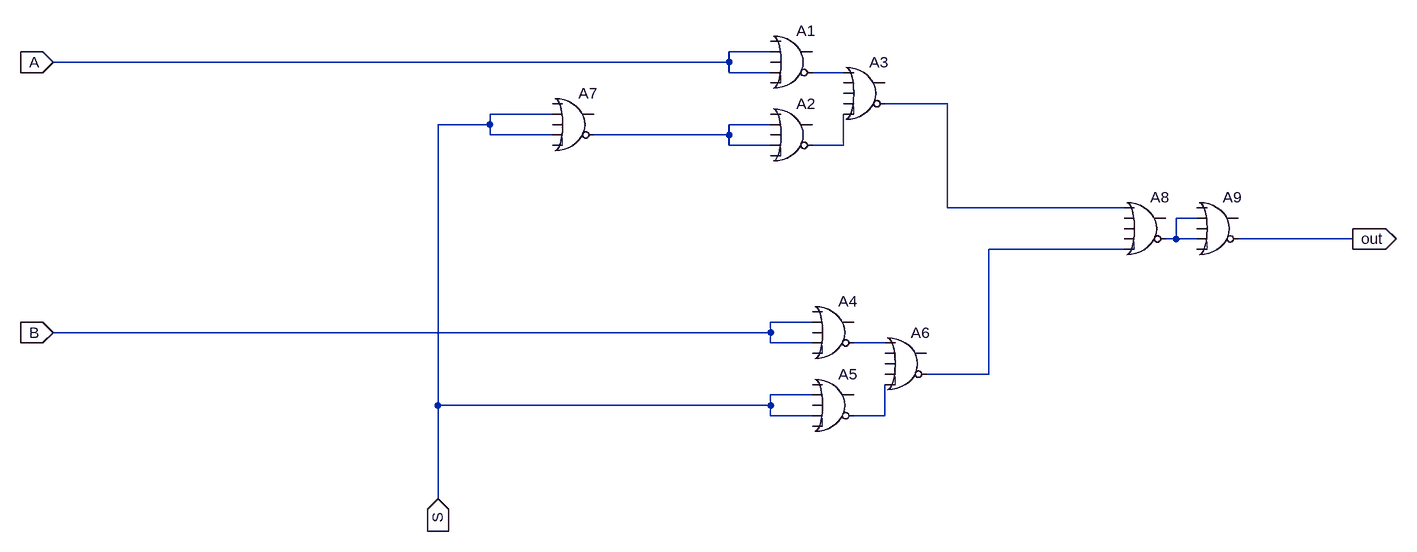
[diagram p0: schematic 2_mux.asc]
2_mux.asc, the LTspice schematic file:
Version 4
SHEET 1 1152 876
WIRE 160 112 96 112
WIRE 96 128 96 112
WIRE 96 128 -944 128
WIRE 96 144 96 128
WIRE 160 144 96 144
WIRE 272 144 224 144
WIRE 432 192 336 192
WIRE -176 208 -272 208
WIRE -272 224 -272 208
WIRE -272 224 -352 224
WIRE 160 224 96 224
WIRE -272 240 -272 224
WIRE -176 240 -272 240
WIRE 96 240 96 224
WIRE 96 240 -112 240
WIRE 96 256 96 240
WIRE 160 256 96 256
WIRE 272 256 272 208
WIRE 272 256 224 256
WIRE 432 352 432 192
WIRE 704 352 432 352
WIRE 816 368 784 368
WIRE 784 400 784 368
WIRE 784 400 768 400
WIRE 816 400 784 400
WIRE 1056 400 880 400
WIRE 704 416 496 416
WIRE 224 528 160 528
WIRE 160 544 160 528
WIRE 160 544 -944 544
WIRE 160 560 160 544
WIRE 224 560 160 560
WIRE 336 560 288 560
WIRE 496 608 496 416
WIRE 496 608 400 608
WIRE 224 640 160 640
WIRE -352 656 -352 224
WIRE 160 656 160 640
WIRE 160 656 -352 656
WIRE 160 672 160 656
WIRE 224 672 160 672
WIRE 336 672 336 624
WIRE 336 672 288 672
WIRE -352 800 -352 656
FLAG -944 128 A
IOPIN -944 128 In
FLAG -944 544 B
IOPIN -944 544 In
FLAG -352 800 S
IOPIN -352 800 In
FLAG 1056 400 out
IOPIN 1056 400 Out
SYMBOL Digital\\or 192 64 R0
SYMATTR InstName A1
SYMBOL Digital\\or 192 176 R0
SYMATTR InstName A2
SYMBOL Digital\\or 304 112 R0
SYMATTR InstName A3
SYMBOL Digital\\or 256 480 R0
SYMATTR InstName A4
SYMBOL Digital\\or 256 592 R0
SYMATTR InstName A5
SYMBOL Digital\\or 368 528 R0
SYMATTR InstName A6
SYMBOL Digital\\or -144 160 R0
SYMATTR InstName A7
SYMBOL Digital\\or 736 320 R0
SYMATTR InstName A8
SYMBOL Digital\\or 848 320 R0
SYMATTR InstName A9

The netlist it stands for:
* 2_mux.asc
A1 0 A 0 A 0 N001 0 0 OR
A2 0 N003 0 N003 0 N004 0 0 OR
A3 N001 0 0 0 N004 N002 0 0 OR
A4 0 B 0 B 0 N007 0 0 OR
A5 0 S 0 S 0 N008 0 0 OR
A6 N007 0 0 0 N008 N006 0 0 OR
A7 0 S 0 S 0 N003 0 0 OR
A8 N002 0 0 0 N006 N005 0 0 OR
A9 0 N005 0 N005 0 out 0 0 OR
.backanno
.end